# Altium schematic sheet STM32.SchDoc
size 299 x 299 mm; SheetNumber: 4; SheetTotal: 13
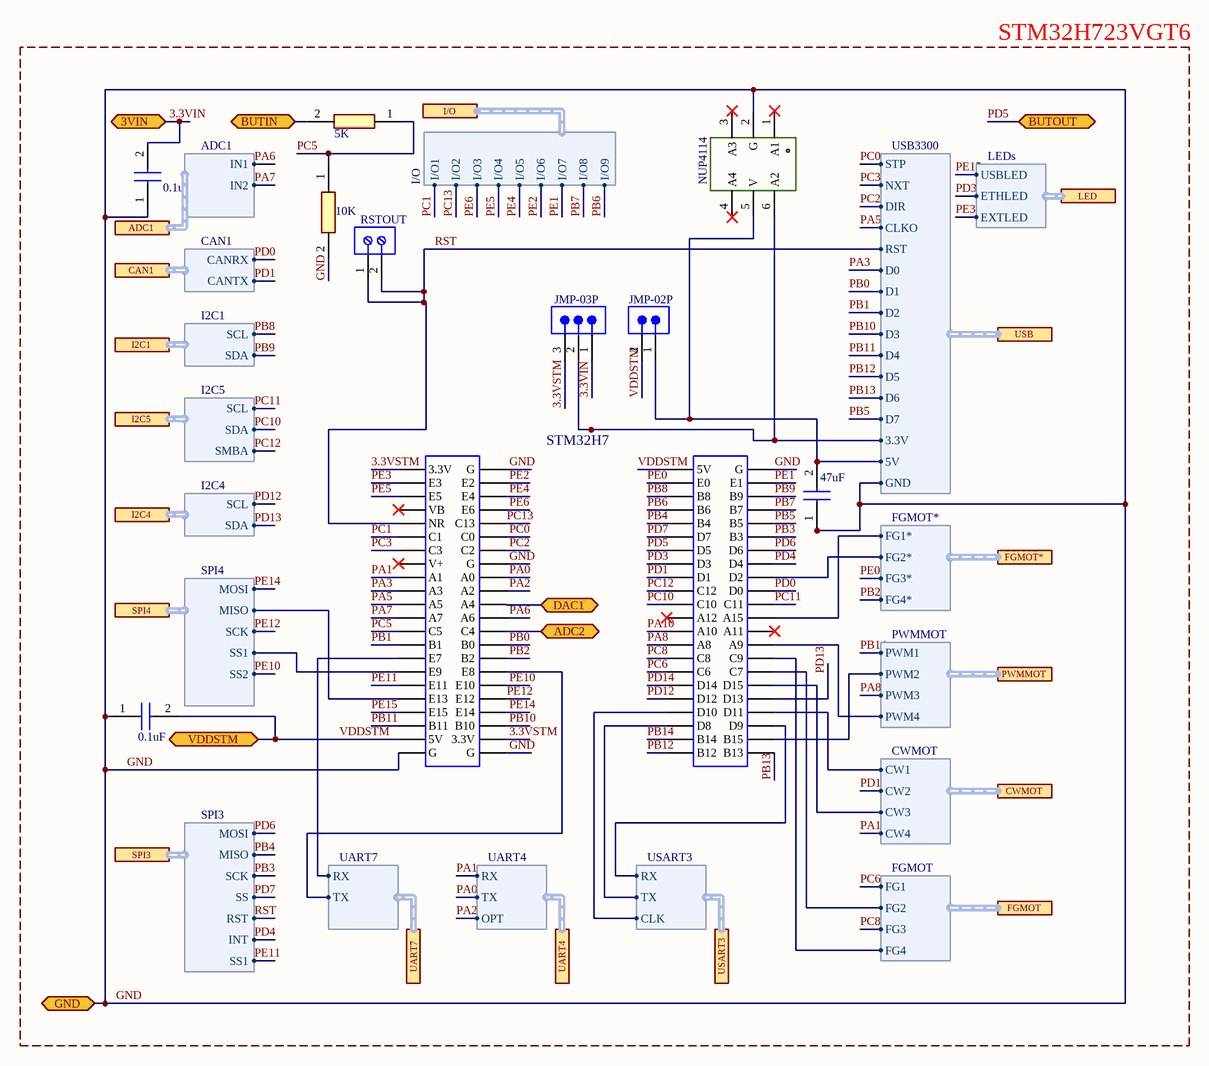
[diagram p0: STM32.SchDoc]

## Parts
BUTIN1  5K  [RES0805]
BUTIN2  10K  [RES0805]
CAP5VUSB  47uF  [К10-17Б]
CAPSTM3V  0.1uF  [CAP0805]
CAPSTM5V  0.1uF  [CAP0805]
ESDUSB  NUP4114  [NUP4114]
JMP3VUSB  JMP-03P  [JMP-03P]
JMP5VUSB  JMP-02P  [JMP-02P]
RSTOUT  DG127-5.0-02P  [DG127-5.0-02P]  (value not drawn)
STM  STM32H7  [STM32H7]  (value not drawn)

## Blocks framed on the sheet
STM32H723VGT6: BUTIN1 BUTIN2 CAP5VUSB CAPSTM3V CAPSTM5V ESDUSB JMP3VUSB JMP5VUSB RSTOUT STM

## Ports
3VIN (bidir, see CONTROL_PCB_MAIN[3B]), ADC1 (harness ADC1, see CONTROL_PCB_MAIN[3C], ADC1[1C]), ADC2 (bidir, see CONTROL_PCB_MAIN[3C]), BUTIN (bidir, see CONTROL_PCB_MAIN[4B]), BUTOUT (bidir, see CONTROL_PCB_MAIN[4B]), CAN1 (harness CAN1, see CONTROL_PCB_MAIN[4C], CAN[2C]), CWMOT (harness CWMOT, see CONTROL_PCB_MAIN[4B], MOTORS[2C]), DAC1 (bidir, see CONTROL_PCB_MAIN[3C]), FGMOT (harness FGMOT, see CONTROL_PCB_MAIN[4B], MOTORS[2C]), FGMOT* (harness FGMOT*, see CONTROL_PCB_MAIN[4C], MOTORS[2C]), GND (bidir, see CONTROL_PCB_MAIN[3C], ADC1[2D], CAN[2C], I2C[2D], I_O[1C], LEDS[1D], MOTORS[2D], RELAY_5V_3.3V_LEVEL[5C], RELAY_12VV_VDD_LEVEL[5B], SPI[1D], UARTSTM[2D]), I2C1 (harness I2C1, see CONTROL_PCB_MAIN[4C], I2C[2B]), I2C4 (harness I2C4, see CONTROL_PCB_MAIN[4C], I2C[2D]), I2C5 (harness I2C5, see CONTROL_PCB_MAIN[4C], I2C[2C]), I/O (harness I/O, see CONTROL_PCB_MAIN[4B], I_O[1B]), LED (harness LEDs, see CONTROL_PCB_MAIN[4B], LEDS[1B]), PWMMOT (harness PWMMOT, see CONTROL_PCB_MAIN[4B], MOTORS[2B]), SPI3 (harness SPI3, see CONTROL_PCB_MAIN[4C], SPI[1C]), SPI4 (harness SPI4, see CONTROL_PCB_MAIN[4C], SPI[1B]), UART4 (harness UART4, see CONTROL_PCB_MAIN[4C], UARTSTM[2C]), UART7 (harness UART7, see CONTROL_PCB_MAIN[4C], UARTSTM[2C]), USART3 (harness USART3, see CONTROL_PCB_MAIN[4C], UARTSTM[2B]), USB (harness USB3300, see CONTROL_PCB_MAIN[4C], USB3300[2C]), VDDSTM (bidir, see CONTROL_PCB_MAIN[3B])

## Harnesses
PWMMOT: PWM1, PWM2, PWM3, PWM4
CWMOT: CW1, CW2, CW3, CW4
FGMOT: FG1, FG2, FG3, FG4
FGMOT*: FG1*, FG2*, FG3*, FG4*
USB3300: D2, D3, D4, D5, D0, D1, DIR, CLKO, RST, STP, NXT, D7, 3.3V, 5V, GND, D6
SPI4: MISO, MOSI, SCK, SS1, SS2
SPI3: MISO, MOSI, SCK, SS, RST, INT, SS1
I2C4: SDA, SCL
I2C5: SDA, SCL, SMBA
I2C1: SDA, SCL
CAN1: CANTX, CANRX
ADC1: IN2, IN1
LEDs: USBLED, ETHLED, EXTLED
I/O: I/O1, I/O2, I/O3, I/O4, I/O5, I/O6, I/O7, I/O8, I/O9
UART7: RX, TX
USART3: RX, TX, CLK
UART4: RX, TX, OPT

## Nets
3.3VIN: CAPSTM3V.2 JMP3VUSB.1 ; port 3VIN
3.3VSTM: JMP3VUSB.3 STM.3.3V
ADC2: STM.C4 ; port ADC2
BUTIN: BUTIN1.2 ; port BUTIN
DAC1: STM.A4 ; port DAC1
GND: BUTIN2.2 CAP5VUSB.1 CAPSTM3V.1 CAPSTM5V.1 ESDUSB.2(G) STM.G ; port GND, port USB.GND
PA0: STM.A0 ; port UART4.TX
PA1: STM.A1 ; port UART4.RX
PA2: STM.A2 ; port UART4.OPT
PA3: STM.A3 ; port USB.D0
PA5: STM.A5 ; port USB.CLKO
PA6: STM.A6 ; port ADC1.IN1
PA7: STM.A7 ; port ADC1.IN2
PA8: STM.A8 ; port PWMMOT.PWM3
PA10: STM.A10 ; port CWMOT.CW4
PB0: STM.B0 ; port USB.D1
PB1: STM.B1 ; port USB.D2
PB2: STM.B2 ; port FGMOT*.FG4*
PB3: STM.B3 ; port SPI3.SCK
PB4: STM.B4 ; port SPI3.MISO
PB5: STM.B5 ; port USB.D7
PB6: STM.B6 ; port I/O.I/O9
PB7: STM.B7 ; port I/O.I/O8
PB8: STM.B8 ; port I2C1.SCL
PB9: STM.B9 ; port I2C1.SDA
PB10: STM.B10 ; port USB.D3
PB11: STM.B11 ; port USB.D4
PB12: STM.B12 ; port USB.D5
PB13: STM.B13 ; port USB.D6
PB14: STM.B14 ; port PWMMOT.PWM1
PC0: STM.C0 ; port USB.STP
PC1: STM.C1 ; port I/O.I/O1
PC2: STM.C2 ; port USB.DIR
PC3: STM.C3 ; port USB.NXT
PC5: BUTIN1.1 BUTIN2.1 STM.C5
PC6: STM.C6 ; port FGMOT.FG1
PC8: STM.C8 ; port FGMOT.FG3
PC10: STM.C10 ; port I2C5.SDA
PC11: STM.C11 ; port I2C5.SCL
PC12: STM.C12 ; port I2C5.SMBA
PC13: STM.C13 ; port I/O.I/O2
PD0: STM.D0 ; port CAN1.CANRX
PD1: STM.D1 ; port CAN1.CANTX
PD3: STM.D3 ; port LED.ETHLED
PD4: STM.D4 ; port SPI3.INT
PD5: STM.D5 ; port BUTOUT
PD6: STM.D6 ; port SPI3.MOSI
PD7: STM.D7 ; port SPI3.SS
PD12: STM.D12 ; port I2C4.SCL
PD13: STM.D13 ; port I2C4.SDA
PD14: STM.D14 ; port CWMOT.CW2
PE0: STM.E0 ; port FGMOT*.FG3*
PE1: STM.E1 ; port I/O.I/O7
PE2: STM.E2 ; port I/O.I/O6
PE3: STM.E3 ; port LED.EXTLED
PE4: STM.E4 ; port I/O.I/O5
PE5: STM.E5 ; port I/O.I/O4
PE6: STM.E6 ; port I/O.I/O3
PE10: STM.E10 ; port SPI4.SS2
PE11: STM.E11 ; port SPI3.SS1
PE12: STM.E12 ; port SPI4.SCK
PE14: STM.E14 ; port SPI4.MOSI
PE15: STM.E15 ; port LED.USBLED
RST: RSTOUT.1 RSTOUT.2 STM.NR ; port USB.RST, port SPI3.RST
VDDSTM: CAPSTM5V.2 JMP5VUSB.2 STM.5V ; port VDDSTM
NetCAP5VUSB_2: CAP5VUSB.2 ESDUSB.5(V) JMP5VUSB.1 ; port USB.5V
NetESDUSB_6: ESDUSB.6(A2) JMP3VUSB.2 ; port USB.3.3V
NetSTM_A9: STM.A9 ; port PWMMOT.PWM4
NetSTM_A15: STM.A15 ; port FGMOT*.FG1*
NetSTM_B15: STM.B15 ; port PWMMOT.PWM2
NetSTM_C7: STM.C7 ; port FGMOT.FG2
NetSTM_C9: STM.C9 ; port FGMOT.FG4
NetSTM_D2: STM.D2 ; port FGMOT*.FG2*
NetSTM_D8: STM.D8 ; port USART3.TX
NetSTM_D9: STM.D9 ; port USART3.RX
NetSTM_D10: STM.D10 ; port USART3.CLK
NetSTM_D11: STM.D11 ; port CWMOT.CW1
NetSTM_D15: STM.D15 ; port CWMOT.CW3
NetSTM_E7: STM.E7 ; port UART7.RX
NetSTM_E8: STM.E8 ; port UART7.TX
NetSTM_E9: STM.E9 ; port SPI4.SS1
NetSTM_E13: STM.E13 ; port SPI4.MISO

Not connected (* = marked no-connect by the designer): ESDUSB 1(A1)* 3(A3)* 4(A4)*; STM A11* A12* V+* VB*

## Library data of the parts
BUTIN1 BUTIN2 = RES0805: RES-SMD0805
CAP5VUSB = CAP: К10-17Б
CAPSTM3V CAPSTM5V = CAP0805: CAP-SMD0805
ESDUSB = NUP4114: NUP4114HMR6T1G
JMP3VUSB = JMP-03P: PLS-1x3
JMP5VUSB = JMP-02P: PLS-1x2
RSTOUT = DG127-5.0-02P: DG127-5.0-02P-14-00Z
STM = STM32H7: STM32H723VGT6